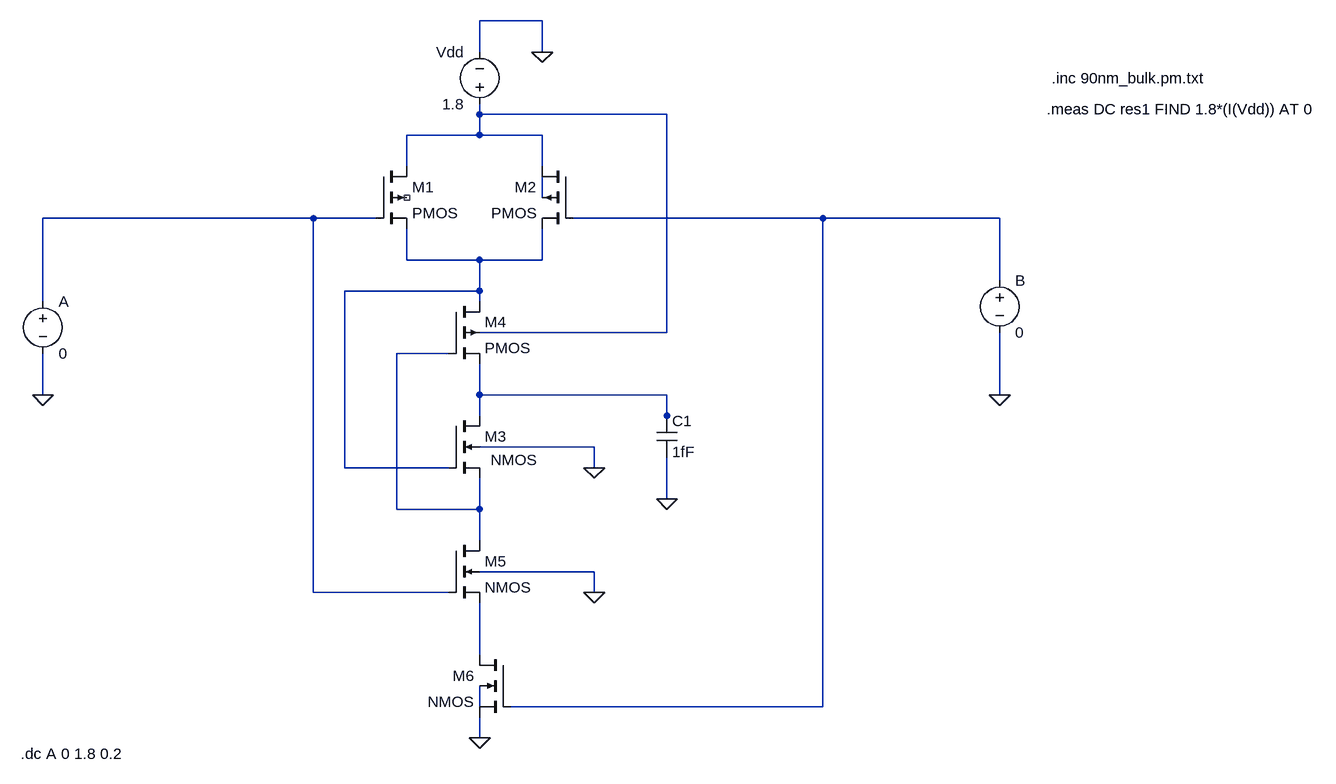
[diagram p0: schematic LCT NAND.asc]
LCT NAND.asc, the LTspice schematic file:
Version 4
SHEET 1 1560 980
WIRE 336 -208 240 -208
WIRE 240 -160 240 -208
WIRE 336 -160 336 -208
WIRE 240 -64 240 -80
WIRE 528 -64 240 -64
WIRE 240 -32 240 -64
WIRE 240 -32 128 -32
WIRE 336 -32 240 -32
WIRE 128 16 128 -32
WIRE 336 16 336 -32
WIRE 336 64 336 32
WIRE -16 96 -432 96
WIRE 80 96 -16 96
WIRE 768 96 384 96
WIRE 1040 96 768 96
WIRE 128 160 128 112
WIRE 240 160 128 160
WIRE 336 160 336 112
WIRE 336 160 240 160
WIRE 1040 192 1040 96
WIRE 240 208 240 160
WIRE 240 208 32 208
WIRE -432 224 -432 96
WIRE 240 224 240 208
WIRE 528 272 528 -64
WIRE 528 272 240 272
WIRE 192 304 112 304
WIRE -432 368 -432 304
WIRE 240 368 240 320
WIRE 528 368 240 368
WIRE 1040 368 1040 272
WIRE 240 400 240 368
WIRE 528 400 528 368
WIRE 528 416 528 400
WIRE 416 448 240 448
WIRE 32 480 32 208
WIRE 192 480 32 480
WIRE 416 480 416 448
WIRE 528 528 528 464
WIRE 112 544 112 304
WIRE 240 544 240 496
WIRE 240 544 112 544
WIRE 240 592 240 544
WIRE 416 640 240 640
WIRE -16 672 -16 96
WIRE 192 672 -16 672
WIRE 416 672 416 640
WIRE 240 768 240 688
WIRE 240 848 240 816
WIRE 768 848 768 96
WIRE 768 848 288 848
WIRE 240 896 240 864
FLAG 240 896 0
FLAG 528 528 0
FLAG -432 368 0
FLAG 1040 368 0
FLAG 336 -160 0
FLAG 416 480 0
FLAG 416 672 0
SYMBOL voltage 240 -64 R180
WINDOW 0 24 96 Left 2
WINDOW 3 24 16 Left 2
WINDOW 123 0 0 Left 0
WINDOW 39 0 0 Left 0
SYMATTR InstName Vdd
SYMATTR Value 1.8
SYMBOL pmos4 80 16 R0
SYMATTR InstName M1
SYMATTR Value2 l=100n w=320n
SYMBOL pmos4 384 16 M0
SYMATTR InstName M2
SYMATTR Value2 l=100n w=320n
SYMBOL nmos4 192 400 R0
WINDOW 3 65 68 Left 2
SYMATTR InstName M3
SYMATTR Value2 l=100n w=120n
SYMBOL pmos4 192 224 R0
SYMATTR InstName M4
SYMATTR Value2 l=100n w=320n
SYMBOL nmos4 192 592 R0
SYMATTR InstName M5
SYMATTR Value2 l=100n w=120n
SYMBOL nmos4 288 768 M0
SYMATTR InstName M6
SYMATTR Value2 l=100n w=120n
SYMBOL cap 512 400 R0
SYMATTR InstName C1
SYMATTR Value 1fF
SYMBOL voltage -432 208 R0
WINDOW 123 0 0 Left 0
WINDOW 39 0 0 Left 0
SYMATTR InstName A
SYMATTR Value 0
SYMBOL voltage 1040 176 R0
WINDOW 123 0 0 Left 0
WINDOW 39 0 0 Left 0
SYMATTR InstName B
SYMATTR Value 0
TEXT 1112 -72 Left 2 !.meas DC res1 FIND 1.8*(I(Vdd)) AT 0
TEXT 1120 -120 Left 2 !.inc 90nm_bulk.pm.txt
TEXT -466 920 Left 2 !.dc A 0 1.8 0.2

The netlist it stands for:
* LCT NAND.asc
Vdd N001 0 1.8
M1 N001 N003 N005 NC_01 PMOS l=100n w=320n
M2 N001 N004 N005 N002 PMOS l=100n w=320n
M3 N007 N005 N006 0 NMOS l=100n w=120n
M4 N005 N006 N007 N001 PMOS l=100n w=320n
M5 N006 N003 N008 0 NMOS l=100n w=120n
M6 N008 N004 0 N009 NMOS l=100n w=120n
C1 N007 0 1fF
V§A N003 0 0
V§B N004 0 0
.model NMOS NMOS
.model PMOS PMOS
.lib standard.mos
.meas DC res1 FIND 1.8*(I(Vdd)) AT 0
.inc 90nm_bulk.pm.txt
.dc A 0 1.8 0.2
.backanno
.end